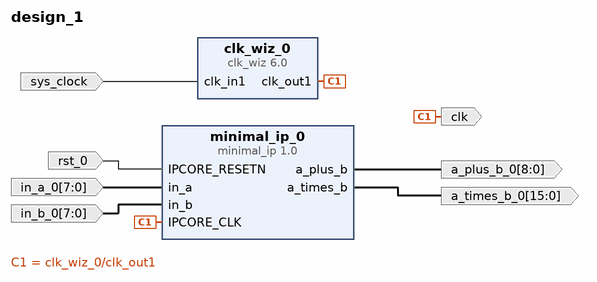
[diagram p0: block diagram of the top level]
# Vivado block design design_1, xc7z010clg400-1, Vivado 2023.2
create_bd_design design_1

create_bd_port -dir I -type clk sys_clock
create_bd_port -dir O clk
create_bd_port -dir I -from 7 -to 0 in_a_0
create_bd_port -dir I -from 7 -to 0 in_b_0
create_bd_port -dir O -from 15 -to 0 a_times_b_0
create_bd_port -dir O -from 8 -to 0 a_plus_b_0
create_bd_port -dir I -type rst rst_0

create_bd_cell -type ip -vlnv user.org:ip:minimal_ip:1.0 minimal_ip_0
create_bd_cell -type ip -vlnv xilinx.com:ip:clk_wiz:6.0 clk_wiz_0
set_property -dict {CONFIG.USE_LOCKED false CONFIG.USE_RESET false} [get_bd_cells clk_wiz_0]

# ---- connections ----

connect_bd_net -net IPCORE_RESETN_0_1 [get_bd_ports rst_0] [get_bd_pins minimal_ip_0/IPCORE_RESETN]
connect_bd_net -net clk_in1_0_1 [get_bd_ports sys_clock] [get_bd_pins clk_wiz_0/clk_in1]
connect_bd_net [get_bd_pins clk_wiz_0/clk_out1] [get_bd_pins minimal_ip_0/IPCORE_CLK] [get_bd_ports clk]
connect_bd_net -net in_a_0_1 [get_bd_ports in_a_0] [get_bd_pins minimal_ip_0/in_a]
connect_bd_net -net in_b_0_1 [get_bd_ports in_b_0] [get_bd_pins minimal_ip_0/in_b]
connect_bd_net [get_bd_pins minimal_ip_0/a_plus_b] [get_bd_ports a_plus_b_0]
connect_bd_net [get_bd_pins minimal_ip_0/a_times_b] [get_bd_ports a_times_b_0]

validate_bd_design
save_bd_design
